# Altium schematic sheet Spindle_Control.SchDoc
size B; Author: AM; CompanyName: Expatria Technologies; DrawnBy: A.Marles; Engineer: AM; Organization: Expatria Technologies; DocumentNumber: 10; Revision: A1; SheetNumber: 10; SheetTotal: 14; PCB_Rev: A1
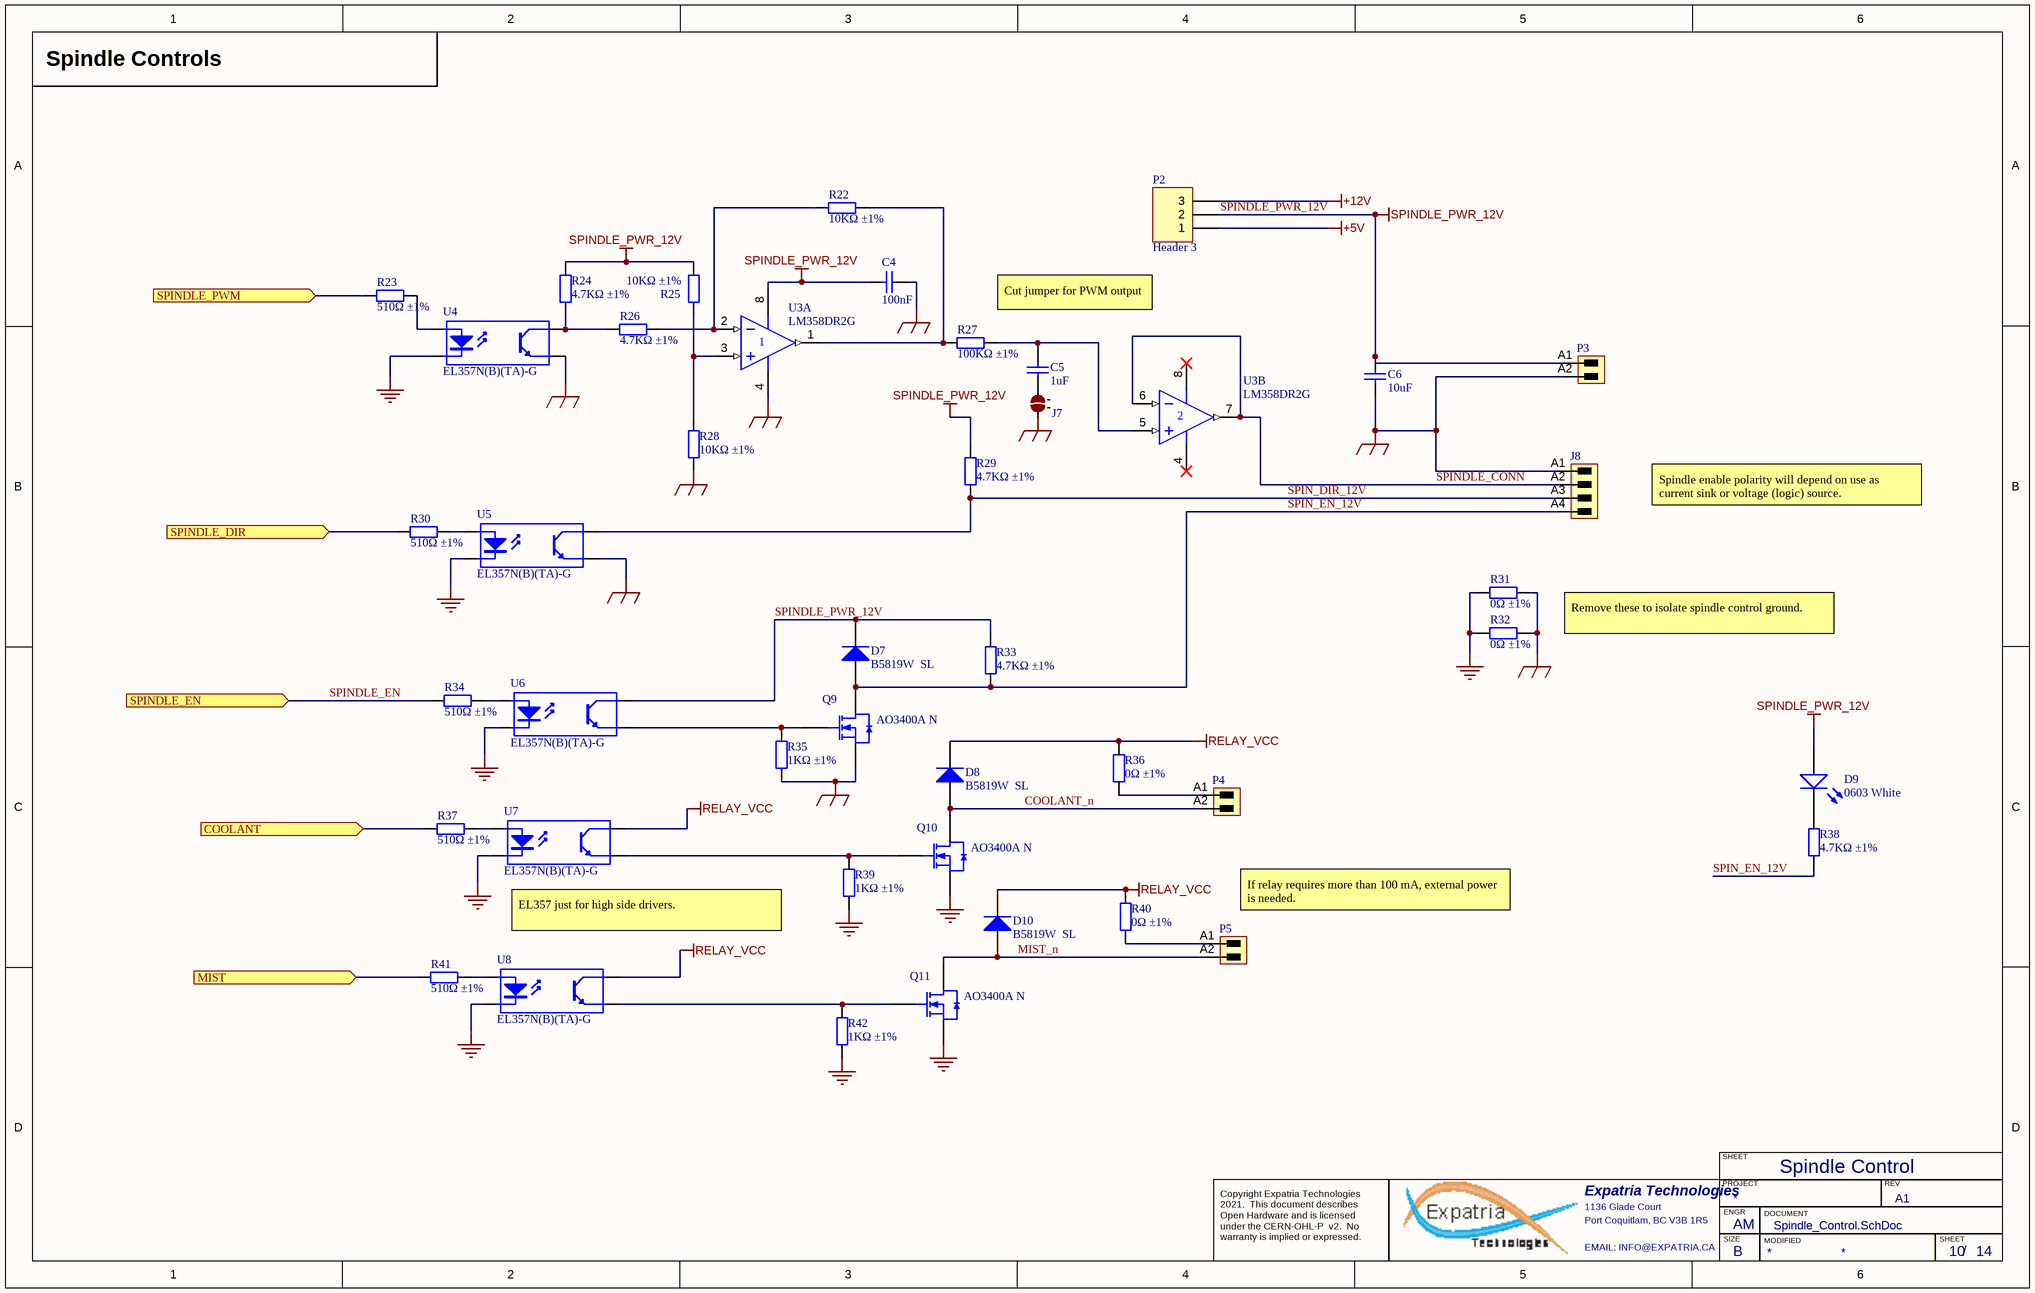
[diagram p0: Spindle_Control.SchDoc]

## Parts
C4  100nF  [0603_C]
C5  1uF  [0603_C]
C6  10uF  [1206_C]
D7  B5819W  SL  [SOD-123]
D8  B5819W  SL  [SOD-123]
D9  0603 White  [0603_LED_S1]
D10  B5819W  SL  [SOD-123]
J7  2 way net solder junction - Normally Open  [2waySolder_NO]  (value not drawn)  (no BOM)
J8  (no value)  [SL_SMT_3_5_180G_04]
P2  Header 3  [HDR1X3]
P3  (no value)  [SL_3_50_180G_02]
P4  (no value)  [SL_3_50_180G_02]
P5  (no value)  [SL_3_50_180G_02]
Q9  AO3400A N  [SOT-23-3L]
Q10  AO3400A N  [SOT-23-3L]
Q11  AO3400A N  [SOT-23-3L]
R22  10KΩ ±1%  [0402_R]
R23  510Ω ±1%  [0402_R]
R24  4.7KΩ ±1%  [0402_R]
R25  10KΩ ±1%  [0402_R]
R26  4.7KΩ ±1%  [0402_R]
R27  100KΩ ±1%  [0402_R]
R28  10KΩ ±1%  [0402_R]
R29  4.7KΩ ±1%  [0402_R]
R30  510Ω ±1%  [0402_R]
R31  0Ω ±1%  [0402_R]
R32  0Ω ±1%  [0402_R]
R33  4.7KΩ ±1%  [0402_R]
R34  510Ω ±1%  [0402_R]
R35  1KΩ ±1%  [0402_R]
R36  0Ω ±1%  [0402_R]
R37  510Ω ±1%  [0402_R]
R38  4.7KΩ ±1%  [0402_R]
R39  1KΩ ±1%  [0402_R]
R40  0Ω ±1%  [0402_R]
R41  510Ω ±1%  [0402_R]
R42  1KΩ ±1%  [0402_R]
U3  LM358DR2G  [SOIC-8_150mil]  (parts A,B of 2)
U4  EL357N(B)(TA)-G  [SOP-4_P2.54]
U5  EL357N(B)(TA)-G  [SOP-4_P2.54]
U6  EL357N(B)(TA)-G  [SOP-4_P2.54]
U7  EL357N(B)(TA)-G  [SOP-4_P2.54]
U8  EL357N(B)(TA)-G  [SOP-4_P2.54]

## Ports
COOLANT (in), MIST (in), SPINDLE_DIR (in), SPINDLE_EN (in), SPINDLE_PWM (in)

## Nets
+5V: P2.1
+12V: P2.3
GND: Q10.2(S) Q11.2(S) R31.1 R32.1 R39.1 R42.1 U4.2(K) U5.2(K) U6.2(K) U7.2(K) U8.2(K)
RELAY_VCC: D8.2(K) D10.2(K) R36.1 R40.1 U7.4(C) U8.4(C)
SPIN_GND: C4.1 C6.1 J7.1 J8.A1 P3.A2 Q9.2(S) R28.2 R31.2 R32.2 R35.2 U3.4(V-) U4.3(E) U5.3(E)
SPINDLE_PWR_12V: C4.2 C6.2 D7.2(K) D9.A P2.2 P3.A1 R24.1 R25.1 R29.2 R33.2 U3.8(V+) U6.4(C)
COOLANT: R37.1 ; port COOLANT
COOLANT_n: D8.1(A) P4.A2 Q10.3(D)
MIST: R41.1 ; port MIST
MIST_n: D10.1(A) P5.A2 Q11.3(D)
SPIN_DIR_12V: J8.A3 R29.1 U5.4(C)
SPIN_EN_12V: D7.1(A) J8.A4 Q9.3(D) R33.1 R38.1
SPINDLE_CONN: J8.A2 U3.6(IN-) U3.7(OUT)
SPINDLE_DIR: R30.1 ; port SPINDLE_DIR
SPINDLE_EN: R34.1 ; port SPINDLE_EN
SPINDLE_PWM: R23.1 ; port SPINDLE_PWM
NetC5_1: C5.1 J7.2
NetC5_2: C5.2 R27.1 U3.5(IN+)
NetD9_K: D9.K R38.2
NetP4_A1: P4.A1 R36.2
NetP5_A1: P5.A1 R40.2
NetQ9_1: Q9.1(G) R35.1 U6.3(E)
NetQ10_1: Q10.1(G) R39.2 U7.3(E)
NetQ11_1: Q11.1(G) R42.2 U8.3(E)
NetR22_1: R22.1 R26.2 U3.2(IN-)
NetR22_2: R22.2 R27.2 U3.1(OUT)
NetR23_2: R23.2 U4.1(A)
NetR24_2: R24.2 R26.1 U4.4(C)
NetR25_2: R25.2 R28.1 U3.3(IN+)
NetR30_2: R30.2 U5.1(A)
NetR34_2: R34.2 U6.1(A)
NetR37_2: R37.2 U7.1(A)
NetR41_2: R41.2 U8.1(A)

## Notes on the sheet
- Spindle Controls
- Cut jumper for PWM output
- Spindle enable polarity will depend on use as current sink or voltage (logic) source.
- Remove these to isolate spindle control ground.
- (near P5) If relay requires more than 100 mA, external power is needed.
- EL357 just for high side drivers.
- Spindle Control
- SHEET
- Expatria Technologies
- 1136 Glade Court
- Port Coquitlam, BC V3B 1R5
- PROJECT
- SIZE
- ENGR
- MODIFIED
- DOCUMENT
- REV
- Copyright Expatria Technologies 2021.  This document describes Open Hardware and is licensed under the CERN-OHL-P  v2.  No warranty is implied or expressed.
- EMAIL: INFO@EXPATRIA.CA
- B
- /

## Library data of the parts
C4 = 0603 100nF (104) 10% 50V: Chip capacitors; Manufacturer: YAGEO; PartNumber: CC0603KRX7R9BB104; Tolerance: 10%; Voltage: 50V; Package: 0603; Supplier: LC; SuppliersPartNumber: C14663; Capacitance: 100nF
C5 = 0603 1uF (105) 10% 50V: Chip capacitors; Manufacturer: Samsung Electro-Mechanics; PartNumber: CL10A105KB8NNNC; Tolerance: 10%; Voltage: 50V; Package: 0603; Supplier: LC; SuppliersPartNumber: C15849; Capacitance: 1uF
C6 = 1206 10uF (106) 10% 50V: Chip capacitors; Manufacturer: Samsung Electro-Mechanics; PartNumber: CL31A106KBHNNNE; Tolerance: 10%; Voltage: 50V; Package: 1206; Supplier: LC; SuppliersPartNumber: C13585; Capacitance: 10uF
D7 D8 D10 = SOD-123 B5819W  SL: Schottky Diode; Package: SOD-123; Supplier: LC; SuppliersPartNumber: C8598
D9 = 0603 LED White: LED; Package: 0603; Supplier: LC; SuppliersPartNumber: C2290; Color: White
J7 = 2waySolderNO
J8 = CMP-1559-01140-1: OMNIMATE Signal - series BL/SL 3.50; PartNumber: 1751264; Manufacturer: Phoenix Contact; Side_termination_characteristic: closed side; Pitch_mm: 3.5 mm; Pitch_inch: 0.138 inch; Short_text_for_material: SL-SMT 3.50/04/180G 3.2SN BK BX; UL_94_flammability_rating: V-0; Solder_pin_length_mm: 3.2 mm; Revision: V1; Packaging: Box; PackageReference: SL_SMT_3_5_180G_04; SuppliersPartNumber: C99845
P2 = Header 3: Header, 3-Pin; Publisher: Altium Limited; SuppliersPartNumber: C49257
P3-P5 = CMP-1559-00901-1: Header,Male Pin,Covered(4 Sided) 2 1 0.138"（3.50mm） 2 P=3.5mm Pluggable System Terminal Block RoHS; PartNumber: WJ15EDGVC-3.5-2P; Manufacturer: Ningbo Kangnex Elec; UL_94_flammability_rating: V-0; Pitch_mm: 3.5 mm; Side_termination_characteristic: closed side; Pitch_inch: 0.138 inch; Solder_pin_length_mm: 3.2 mm; Short_text_for_material: SL 3.50/02/180G 3.2SN OR BX; Revision: V1; PackageReference: SL_3_50_180G_02; Packaging: Box; SuppliersPartNumber: C192777
Q9-Q11 = AO3400A N道沟 X0YV1T SOT-23: MOS(场效应管); Package: SOT-23; Supplier: LC; SuppliersPartNumber: C20917
R22 R25 R28 = 0402 10K (1002) 1%: Chip resistor; Manufacturer: Uniroyal Elec; PartNumber: 0402WGF1002TCE; Power: 1/16W; Package: 0402; Supplier: LC; SuppliersPartNumber: C25744; Resistance: 10KΩ; Tolerance: 1%
R23 R30 R34 R37 R41 = 0402 510R (5100) 1%: Chip resistor; Manufacturer: Uniroyal Elec; PartNumber: 0402WGF5100TCE; Power: 1/16W; Package: 0402; Supplier: LC; SuppliersPartNumber: C25123; Resistance: 510Ω; Tolerance: 1%
R24 R26 R29 R33 R38 = 0402 4.7K (4701) 1%: Chip resistor; Manufacturer: Uniroyal Elec; PartNumber: 0402WGF4701TCE; Power: 1/16W; Package: 0402; Supplier: LC; SuppliersPartNumber: C25900; Resistance: 4.7KΩ; Tolerance: 1%
R27 = 0402 100K (1003) 1%: Chip resistor; Manufacturer: Uniroyal Elec; PartNumber: 0402WGF1003TCE; Power: 1/16W; Package: 0402; Supplier: LC; SuppliersPartNumber: C25741; Resistance: 100KΩ; Tolerance: 1%
R31 R32 R36 R40 = 0402 0R (0R0) 1%: Chip resistor; Manufacturer: Uniroyal Elec; PartNumber: 0402WGF0000TCE; Power: 1/16W; Package: 0402; Supplier: LC; SuppliersPartNumber: C17168; Resistance: 0Ω; Tolerance: 1%
R35 R39 R42 = 0402 1K (1001) 1%: Chip resistor; Manufacturer: Uniroyal Elec; PartNumber: 0402WGF1001TCE; Power: 1/16W; Package: 0402; Supplier: LC; SuppliersPartNumber: C11702; Resistance: 1KΩ; Tolerance: 1%; ComponentLink1Description: Supplier link; ComponentLink1URL: http://www.szlcsc.com/product/details_12256.html
U3 = LM358DR2G_[C7950]: LM358DR2G,  Dual Op Amp,  5 - 28 V,  8-PinSOIC; Manufacturer 1: ON Semiconductor; Package: SOIC-8; Supplier: LC; SuppliersPartNumber: C7950; Manufacturer Part Number 1: LM358DR2G; Packaging: Tape and Reel; Length: 5mm
U4-U8 = EL357N(B)(TA)-G_[C6649]: Optocoupler SOP-4, EL357N(B)(TA)-G, Everlight Electronics; Package: SOP-4_P2.54; Supplier: LC; SuppliersPartNumber: C6649; Manufacturer 1: Everlight; Manufacturer Part Number 1: EL357N(B)(TA)-G